# EAGLE design ADC (EAGLE 7.7.0)
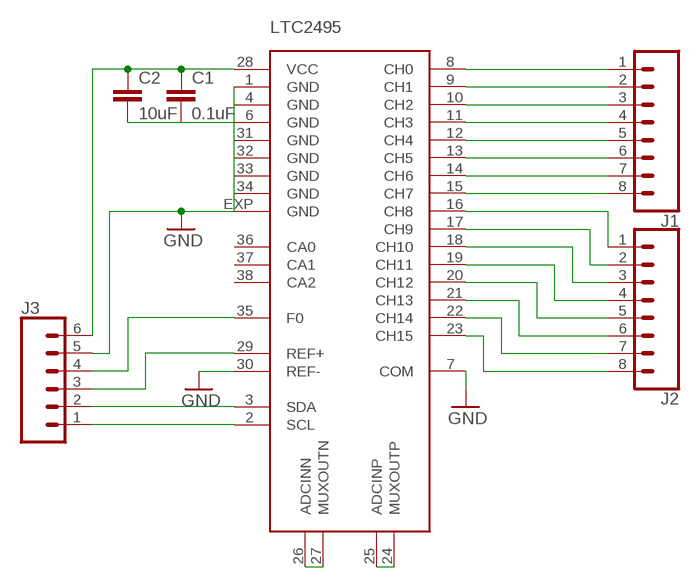
[diagram p0: schematic, sheet 1]

## Parts
C1  0.1uF  C-EUC0603  [C0603]
C2  10uF  C-EUC0805  [C0805]
J1  CONN_08LONGPADS  [1X08_LONGPADS]
J2  CONN_08LONGPADS  [1X08_LONGPADS]
J3  CONN_06LONGPADS  [1X06_LONGPADS]
U$1  LTC2495  [QFN38-5X7]

## Nets
GND: C1.2 C2.2 J3.5 U$1.1(GND) U$1.4(GND) U$1.6(GND) U$1.7(COM) U$1.30(REF-) U$1.31(GND) U$1.32(GND) U$1.33(GND) U$1.34(GND) U$1.EXP(GND)
N$1: J3.1 U$1.2(SCL)
N$2: J3.2 U$1.3(SDA)
N$3: J3.3 U$1.29(REF+)
N$4: J3.4 U$1.35(F0)
N$6: C1.1 C2.1 J3.6 U$1.28(VCC)
N$8: U$1.26(ADCINN) U$1.27(MUXOUTN)
N$9: U$1.24(MUXOUTP) U$1.25(ADCINP)
N$10: J1.8 U$1.15(CH7)
N$11: J1.7 U$1.14(CH6)
N$12: J1.6 U$1.13(CH5)
N$13: J1.5 U$1.12(CH4)
N$14: J1.4 U$1.11(CH3)
N$15: J1.3 U$1.10(CH2)
N$16: J1.2 U$1.9(CH1)
N$17: J1.1 U$1.8(CH0)
N$18: J2.1 U$1.16(CH8)
N$19: J2.2 U$1.17(CH9)
N$20: J2.3 U$1.18(CH10)
N$21: J2.4 U$1.19(CH11)
N$22: J2.5 U$1.20(CH12)
N$23: J2.6 U$1.21(CH13)
N$24: J2.7 U$1.22(CH14)
N$25: J2.8 U$1.23(CH15)
Unconnected: U$1.36(CA0) U$1.37(CA1) U$1.38(CA2)

## Library data of the parts
C1 C2 = rcl:C-EU: CAPACITOR, European symbol
J1 J2 = SparkFun-Connectors:CONN_08: Multi connection point. Often used as Generic Header-pin footprint for 0.1 inch spaced/style header connections On any of the 0.1 inch spaced packages, you can populate with these: Break Away Headers - Straight <https://www.sparkfun.com/products/116> (PRT-00116) Break Away Male Headers - Right Angle <https://www.sparkfun.com/products/553> (PRT-00553) Female Headers <https://www.sparkfun.com/products/115> (PRT-00115) Break Away Headers - Machine Pin <https://www.sparkfun.com/products/117> (PRT-00117) Break Away Female Headers - Swiss Machine Pin <https://www.sparkfun.com/products/743> (PRT-00743) Arduino Stackable Header - 8 Pin <https://www.sparkfun.com/products/9279> (PRT-09279) For SCREWTERMINALS and SPRING TERMINALS visit here: Screw Terimnals on SparkFun.com <https://www.sparkfun.com/search/results?term=Screw+Terminals> (5mm/3.5mm/2.54mm spacing) This device is also useful as a general connection point to wire up your design to another part of your project. Our various solder wires solder well into these plated through hole pads. Hook-Up Wire - Assortment (Stranded, 22 AWG) <https://www.sparkfun.com/products/11375> (PRT-11375) Hook-Up Wire - Assortment (Solid Core, 22 AWG) <https://www.sparkfun.com/products/11367> (PRT-11367) View the entire wire category on our website here <https://www.sparkfun.com/categories/141> Special notes: Molex polarized connector foot print use with SKU : PRT-08231 with associated crimp pins and housings. 1MM SMD Version SKU: PRT-10208 NOTES ON THE VARIANTS LOCK and LOCK_LONGPADS... This footprint was designed to help hold the alignment of a through-hole component (i.e. 6-pin header) while soldering it into place. You may notice that each hole has been shifted either up or down by 0.005 of an inch from it's more standard position (which is a perfectly straight line). This slight alteration caused the pins (the squares in the middle) to touch the edges of the holes. Because they are alternating, it causes a "brace" to hold the component in place. 0.005 has proven to be the perfect amount of "off-center" position when using our standard breakaway headers. Although looks a little odd when you look at the bare footprint, once you have a header in there, the alteration is very hard to notice. Also,if you push a header all the way into place, it is covered up entirely on the bottom side.
J3 = SparkFun-Connectors:CONN_06: Multi connection point. Often used as Generic Header-pin footprint for 0.1 inch spaced/style header connections On any of the 0.1 inch spaced packages, you can populate with these: Break Away Headers - Straight <https://www.sparkfun.com/products/116> (PRT-00116) Break Away Male Headers - Right Angle <https://www.sparkfun.com/products/553> (PRT-00553) Female Headers <https://www.sparkfun.com/products/115> (PRT-00115) Break Away Headers - Machine Pin <https://www.sparkfun.com/products/117> (PRT-00117) Break Away Female Headers - Swiss Machine Pin <https://www.sparkfun.com/products/743> (PRT-00743) Arduino Stackable Header - 6 Pin <https://www.sparkfun.com/products/9280> (PRT-09280) For SCREWTERMINALS and SPRING TERMINALS visit here: Screw Terimnals on SparkFun.com <https://www.sparkfun.com/search/results?term=Screw+Terminals> (5mm/3.5mm/2.54mm spacing) This device is also useful as a general connection point to wire up your design to another part of your project. Our various solder wires solder well into these plated through hole pads. Hook-Up Wire - Assortment (Stranded, 22 AWG) <https://www.sparkfun.com/products/11375> (PRT-11375) Hook-Up Wire - Assortment (Solid Core, 22 AWG) <https://www.sparkfun.com/products/11367> (PRT-11367) View the entire wire category on our website here <https://www.sparkfun.com/categories/141>
U$1 = linear-technology:LTC2495

## Board
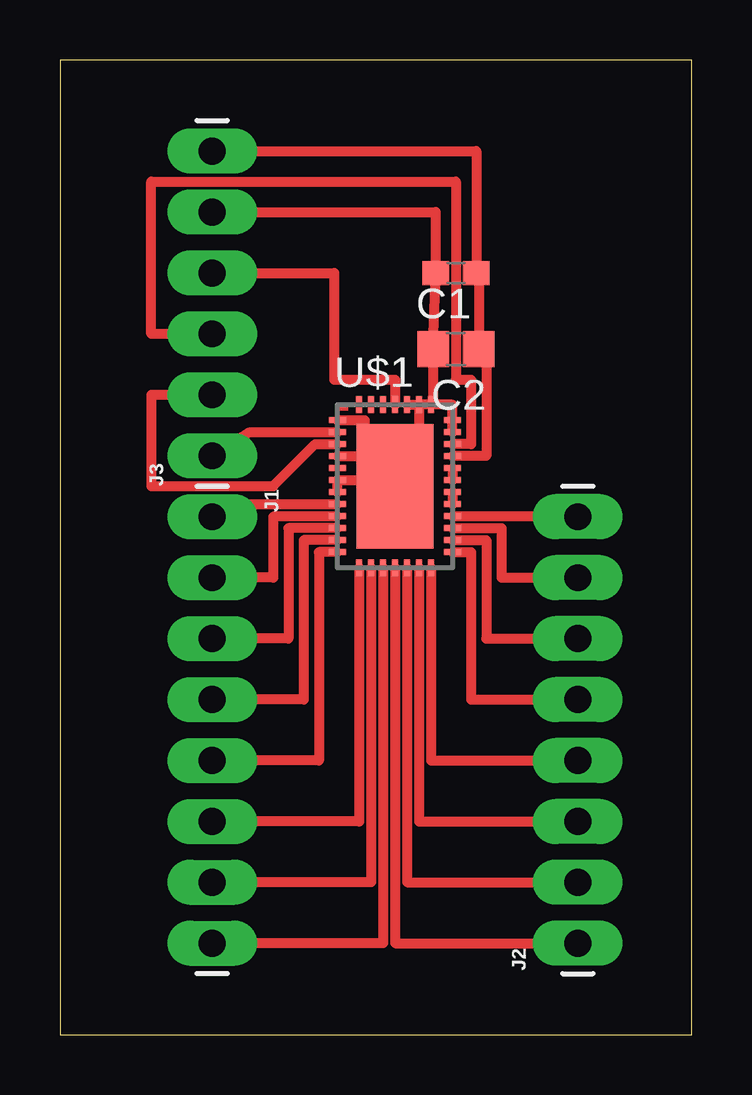
[diagram p1: board, top side]

Size 26.34 x 40.63 mm. Coordinates in mm from the lower left corner, seen from the top.
Outline: 0,0 26.34,0 26.34,40.63 0,40.63 0,0
Copper layers (1*16): Top 0.035mm / dielectric 1.5mm / Bottom 0.035mm
Design rules "default": minimum track width 10mil, minimum drill 24mil, track to track 8mil, track to pad 8mil, pad to pad 8mil, via to via 8mil, smd to smd 8mil, copper to edge 40mil, drill to drill 8mil, minimum pad ring 10mil, minimum via ring 8mil, stop-mask expansion 4mil, vias tented up to drill 0mil, thermal gap 10mil

### Footprints (pad centres in the part's own frame; a part is rotated, then mirrored left to right if it is on the bottom)
C0603 = smd 1.1 x 1: 1 -0.85,0; 2 0.85,0
C0805 = smd 1.3 x 1.5: 1 -0.95,0; 2 0.95,0
1X08_LONGPADS = drill 1.118 pad 1.88 long: 1 0,0; 2 2.54,0; 3 5.08,0; 4 7.62,0; 5 10.16,0; 6 12.7,0; 7 15.24,0; 8 17.78,0
1X06_LONGPADS = drill 1.118 pad 1.88 long: 1 0,0; 2 2.54,0; 3 5.08,0; 4 7.62,0; 5 10.16,0; 6 12.7,0
QFN38-5X7 = smd 0.7 x 0.25: 1 -2.4,2.75; 2 -2.4,2.25; 3 -2.4,1.75; 4 -2.4,1.25; 5 -2.4,0.75; 6 -2.4,0.25; 7 -2.4,-0.25; 8 -2.4,-0.75; 9 -2.4,-1.25; 10 -2.4,-1.75; 11 -2.4,-2.25; 12 -2.4,-2.75; 20 2.4,-2.75; 21 2.4,-2.25; 22 2.4,-1.75; 23 2.4,-1.25; 24 2.4,-0.75; 25 2.4,-0.25; 26 2.4,0.25; 27 2.4,0.75; 28 2.4,1.25; 29 2.4,1.75; 30 2.4,2.25; 31 2.4,2.75 | smd 0.25 x 0.7: 13 -1.5,-3.4; 14 -1,-3.4; 15 -0.5,-3.4; 16 0,-3.4; 17 0.5,-3.4; 18 1,-3.4; 19 1.5,-3.4; 32 1.5,3.4; 33 1,3.4; 34 0.5,3.4; 35 0,3.4; 36 -0.5,3.4; 37 -1,3.4; 38 -1.5,3.4 | smd 3.2 x 5.2: EXP 0,0

### Placement (x,y rotation side)
C1  16.51,31.75 180 top
C2  16.51,28.57 180 top
J1  6.35,21.59 270 top
J2  21.59,3.81 90 top
J3  6.35,24.13 90 top
U$1  13.97,22.86 0 top

### Tracks (layer width: path | path; a pad name or v marks a point on that pad's centre or on a via)
GND
  Top 0.406: 12.7,23.11 U$1.6 U$1.7 | 12.7,23.11 12.7,22.86 U$1.EXP 14.97,22.86 U$1.33 | U$1.34 U$1.33 | U$1.32 U$1.33 | U$1.32 16.37,26.26 U$1.31 U$1.30 | U$1.1 12.7,25.61 12.7,24.11 | 12.7,24.11 12.7,23.11 | U$1.4 12.7,24.11 | J3.5 15.66,34.29 C1.2 15.56,29.21 C2.2 15.56,26.35 U$1.32
N$1
  Top 0.406: J3.1 7.91,25.11 U$1.2
N$2
  Top 0.406: J3.2 3.81,26.67 3.81,22.86 8.89,22.86 10.64,24.61 U$1.3
N$3
  Top 0.406: J3.3 3.81,29.21 3.81,35.56 16.51,35.56 16.51,27.3 17.14,27.3 17.14,24.61 U$1.29
N$4
  Top 0.406: J3.4 11.43,31.75 11.43,27.3 13.97,27.3 U$1.35
N$6
  Top 0.406: U$1.28 16.37,24.13 17.78,24.13 17.78,27.94 C2.1 17.46,31.75 C1.1 17.36,36.83 J3.6
N$8
  Top 0.406: U$1.27 U$1.26
N$9
  Top 0.406: U$1.25 U$1.24
N$10
  Top 0.406: U$1.15 13.47,3.81 J1.8
N$11
  Top 0.406: U$1.14 12.97,6.35 J1.7
N$12
  Top 0.406: U$1.13 12.47,8.89 J1.6
N$13
  Top 0.406: U$1.12 10.79,20.11 10.79,11.43 J1.5
N$14
  Top 0.406: U$1.11 10.16,20.61 10.16,13.97 J1.4
N$15
  Top 0.406: U$1.10 9.53,21.11 9.53,16.51 J1.3
N$16
  Top 0.406: U$1.9 11.55,21.59 8.89,21.59 8.89,19.05 J1.2
N$17
  Top 0.406: J1.1 6.87,22.11 U$1.8
N$18
  Top 0.406: U$1.16 13.97,3.81 J2.1 22.86,3.81
N$19
  Top 0.406: U$1.17 14.47,6.35 J2.2
N$20
  Top 0.406: U$1.18 14.97,8.89 J2.3
N$21
  Top 0.406: U$1.19 15.47,11.43 J2.4
N$22
  Top 0.406: U$1.20 17.14,20.11 17.14,13.97 J2.5
N$23
  Top 0.406: U$1.21 17.78,20.61 17.78,16.51 J2.6
N$24
  Top 0.406: U$1.22 18.41,21.11 18.41,19.05 J2.7
N$25
  Top 0.406: U$1.23 21.59,21.61 J2.8